# EasyEDA schematic FFB_Arduino_Yoke_2.0_YokeBoard.json
TITLE: Yoke Board 2.0; REV: 1.0; Date: 10.02.2025; Sheet: 1/1; Drawn By: gagagu; Company: Gagagu
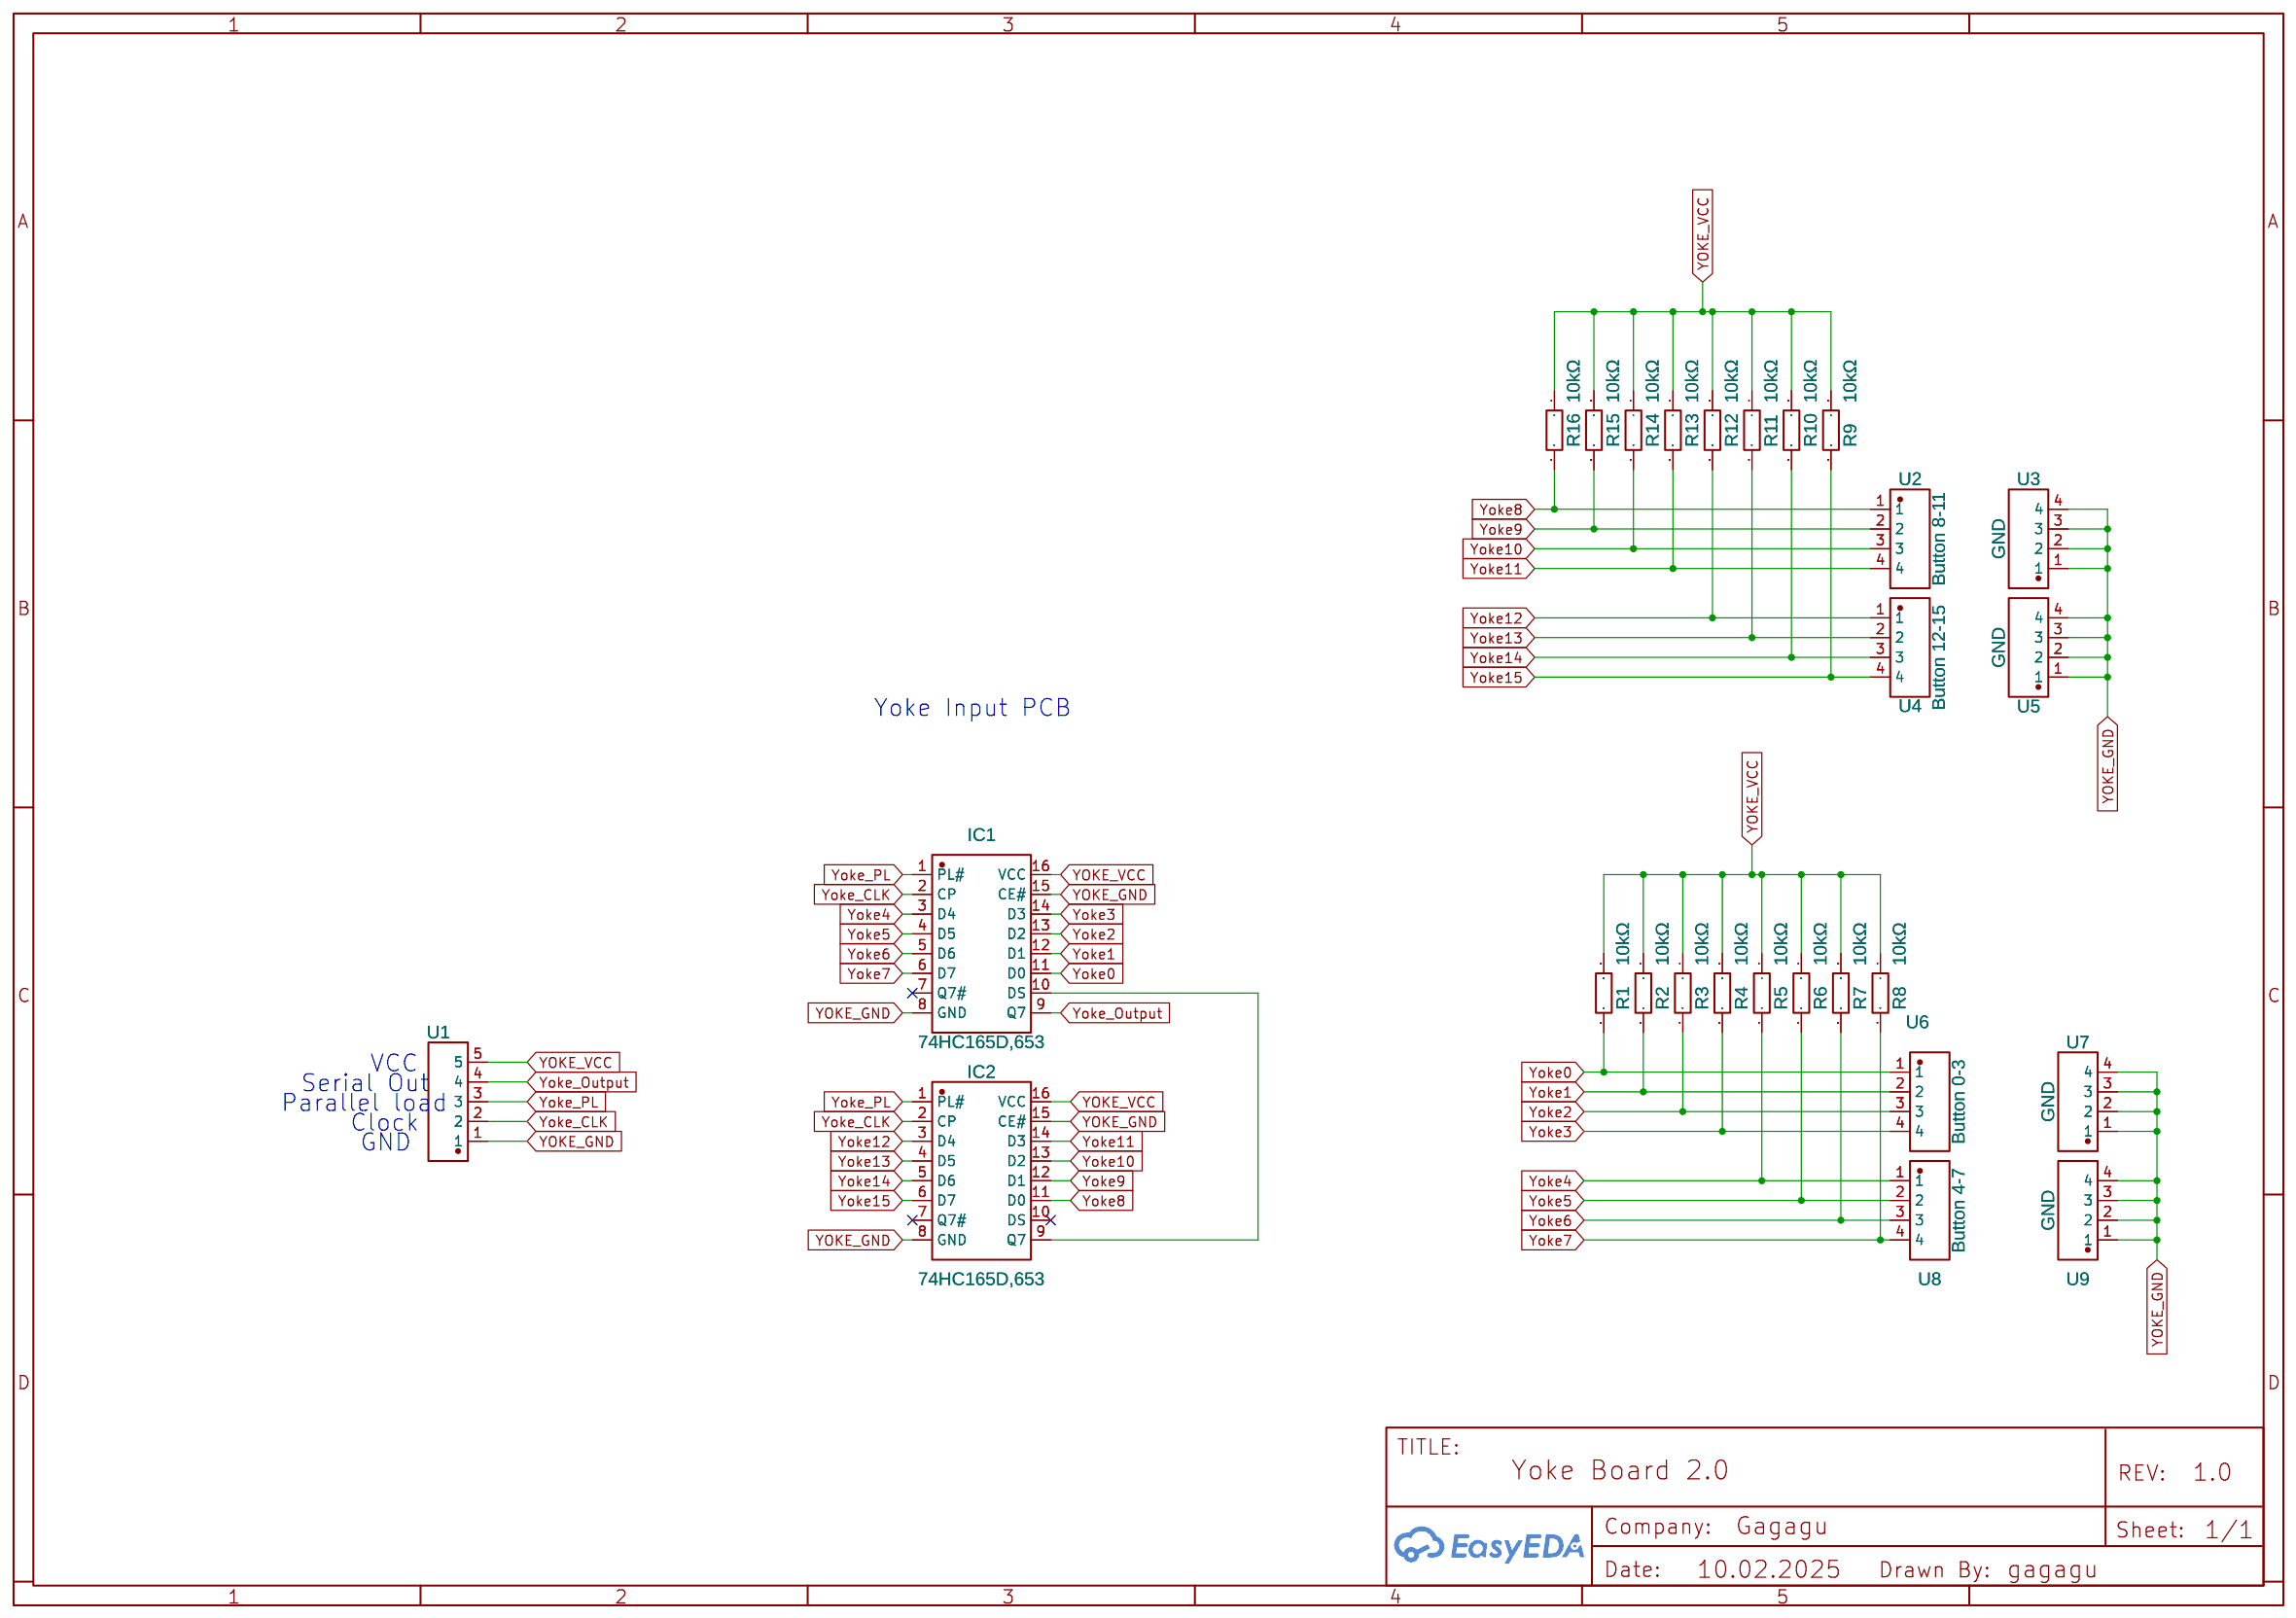
[diagram p0: schematic sheet]

## Parts
IC1  74HC165D,653  [SOIC-16_L9.9-W3.9-P1.27-LS6.0-BL]
IC2  74HC165D,653  [SOIC-16_L9.9-W3.9-P1.27-LS6.0-BL]
R1  10kΩ  [R0603]
R2  10kΩ  [R0603]
R3  10kΩ  [R0603]
R4  10kΩ  [R0603]
R5  10kΩ  [R0603]
R6  10kΩ  [R0603]
R7  10kΩ  [R0603]
R8  10kΩ  [R0603]
R9  10kΩ  [R0603]
R10  10kΩ  [R0603]
R11  10kΩ  [R0603]
R12  10kΩ  [R0603]
R13  10kΩ  [R0603]
R14  10kΩ  [R0603]
R15  10kΩ  [R0603]
R16  10kΩ  [R0603]
U1  Yoke  [CONN-TH_5P-P2.54_MX128-2.54-05P-GN01-CU-Y-A]
U2  Button 8-11  [CONN-TH_4P-P2.54_MX128-2.54-GN01-04P-CU-Y-A]
U3  GND  [CONN-TH_4P-P2.54_MX128-2.54-GN01-04P-CU-Y-A]
U4  Button 12-15  [CONN-TH_4P-P2.54_MX128-2.54-GN01-04P-CU-Y-A]
U5  GND  [CONN-TH_4P-P2.54_MX128-2.54-GN01-04P-CU-Y-A]
U6  Button 0-3  [CONN-TH_4P-P2.54_MX128-2.54-GN01-04P-CU-Y-A]
U7  GND  [CONN-TH_4P-P2.54_MX128-2.54-GN01-04P-CU-Y-A]
U8  Button 4-7  [CONN-TH_4P-P2.54_MX128-2.54-GN01-04P-CU-Y-A]
U9  GND  [CONN-TH_4P-P2.54_MX128-2.54-GN01-04P-CU-Y-A]

## Library data of the parts
IC1 IC2 = 74HC165D,653: Supplier: LCSC; Manufacturer: Nexperia(安世); Supplier Part: C5613; JLCPCB Part Class: Extended Part
R1-R16 = 0603WAF1002T5E: Supplier: LCSC; Manufacturer: UNI-ROYAL(厚声); Supplier Part: C25804; JLCPCB Part Class: Basic Part
U1 = MX128-2.54-05P-GN01-CU-Y-A: Supplier: LCSC; Supplier Part: C5188445; Manufacturer: MAX(迈旭); Manufacturer Part: MX128-2.54-05P-GN01-Cu-Y-A; Contributor: Sauro Giovanetti; JLCPCB Part Class: Extended Part
U2-U9 = MX128-2.54-04P-GN01-CU-Y-A: Supplier: LCSC; Supplier Part: C5188444; Manufacturer: MAX(迈旭); Manufacturer Part: MX128-2.54-04P-GN01-Cu-Y-A; JLCPCB Part Class: Extended Part; Contributor: lcsc

## Nets
Yoke0: IC1.11(D0) R1.2 U6.1
Yoke1: IC1.12(D1) R2.2 U6.2
Yoke2: IC1.13(D2) R3.2 U6.3
Yoke3: IC1.14(D3) R4.2 U6.4
Yoke4: IC1.3(D4) R5.2 U8.1
Yoke5: IC1.4(D5) R6.2 U8.2
Yoke6: IC1.5(D6) R7.2 U8.3
Yoke7: IC1.6(D7) R8.2 U8.4
Yoke8: IC2.11(D0) R16.2 U2.1
Yoke9: IC2.12(D1) R15.2 U2.2
Yoke10: IC2.13(D2) R14.2 U2.3
Yoke11: IC2.14(D3) R13.2 U2.4
Yoke12: IC2.3(D4) R12.2 U4.1
Yoke13: IC2.4(D5) R11.2 U4.2
Yoke14: IC2.5(D6) R10.2 U4.3
Yoke15: IC2.6(D7) R9.2 U4.4
Yoke_CLK: IC1.2(CP) IC2.2(CP) U1.2
YOKE_GND: IC1.8(GND) IC1.15(CE#) IC2.8(GND) IC2.15(CE#) U1.1 U3.1 U3.2 U3.3 U3.4 U5.1 U5.2 U5.3 U5.4 U7.1 U7.2 U7.3 U7.4 U9.1 U9.2 U9.3 U9.4
Yoke_Output: IC1.9(Q7) U1.4
Yoke_PL: IC1.1(PL#) IC2.1(PL#) U1.3
YOKE_VCC: IC1.16(VCC) IC2.16(VCC) R1.1 R2.1 R3.1 R4.1 R5.1 R6.1 R7.1 R8.1 R9.1 R10.1 R11.1 R12.1 R13.1 R14.1 R15.1 R16.1 U1.5
Net-(IC1-10): IC1.10(DS) IC2.9(Q7)

Not connected (* = marked no-connect by the designer): IC1 7(Q7#)*; IC2 7(Q7#)* 10(DS)*

## Notes on the sheet
- Yoke Input PCB
- Serial Out
- VCC
- Parallel load
- Clock
- GND
